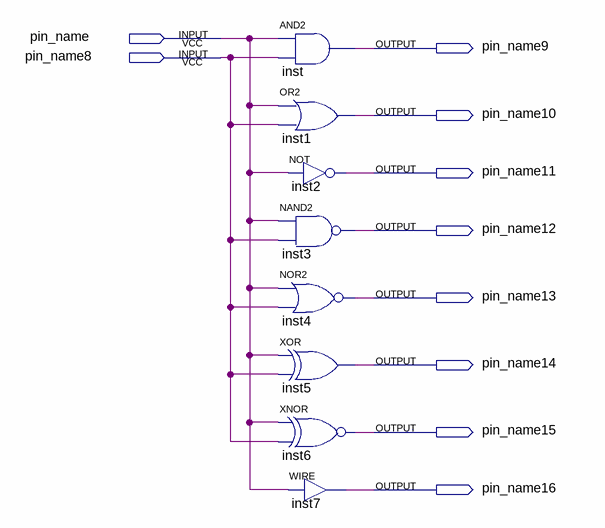
[diagram p0: schematic sheet]
// Quartus schematic 20201023.bdf as structural Verilog: 8 symbols, 10 pins
module \20201023  (
  input  pin_name,
  input  pin_name8,
  output pin_name9,
  output pin_name10,
  output pin_name11,
  output pin_name12,
  output pin_name13,
  output pin_name14,
  output pin_name15,
  output pin_name16
);

  and inst (pin_name9, pin_name, pin_name8);
  or inst1 (pin_name10, pin_name, pin_name8);
  not inst2 (pin_name11, pin_name);
  nand inst3 (pin_name12, pin_name, pin_name8);
  nor inst4 (pin_name13, pin_name, pin_name8);
  xor inst5 (pin_name14, pin_name, pin_name8);
  xnor inst6 (pin_name15, pin_name, pin_name8);
  assign pin_name16 = pin_name;  // WIRE inst7
endmodule
